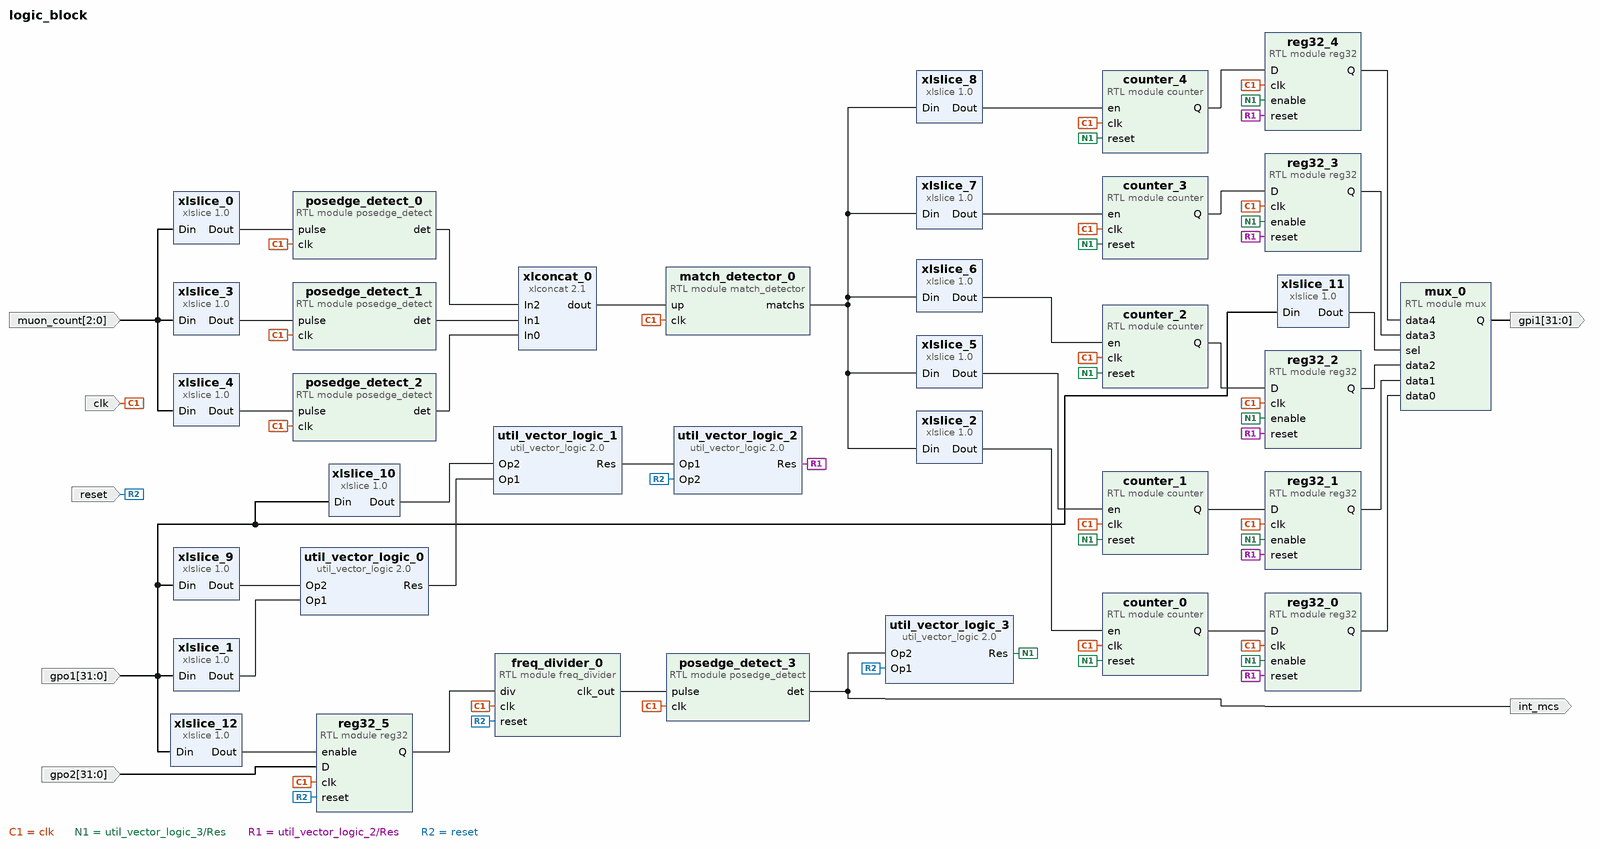
[diagram p0: block diagram of the top level]
# Vivado block design logic_block, xc7a15tcpg236-1, Vivado 2020.2
create_bd_design logic_block

create_bd_port -dir I -from 2 -to 0 -type data muon_count
create_bd_port -dir I -from 31 -to 0 -type data gpo1
create_bd_port -dir I -type rst reset
set_property -dict {CONFIG.POLARITY ACTIVE_HIGH} [get_bd_ports reset]
create_bd_port -dir I -type clk clk
set_property -dict {CONFIG.FREQ_HZ 1000000000} [get_bd_ports clk]
create_bd_port -dir I -from 31 -to 0 -type data gpo2
create_bd_port -dir O -from 31 -to 0 -type data gpi1
create_bd_port -dir O -type data int_mcs

create_bd_cell -type module -reference counter counter_0
create_bd_cell -type module -reference counter counter_1
create_bd_cell -type module -reference counter counter_2
create_bd_cell -type module -reference counter counter_3
create_bd_cell -type module -reference counter counter_4
create_bd_cell -type module -reference freq_divider freq_divider_0
create_bd_cell -type module -reference match_detector match_detector_0
create_bd_cell -type module -reference mux mux_0
create_bd_cell -type module -reference posedge_detect posedge_detect_0
create_bd_cell -type module -reference posedge_detect posedge_detect_1
create_bd_cell -type module -reference posedge_detect posedge_detect_3
create_bd_cell -type module -reference posedge_detect posedge_detect_2
create_bd_cell -type module -reference reg32 reg32_0
create_bd_cell -type module -reference reg32 reg32_1
create_bd_cell -type module -reference reg32 reg32_5
create_bd_cell -type module -reference reg32 reg32_2
create_bd_cell -type module -reference reg32 reg32_3
create_bd_cell -type module -reference reg32 reg32_4
create_bd_cell -type ip -vlnv xilinx.com:ip:util_vector_logic:2.0 util_vector_logic_0
set_property -dict {CONFIG.C_SIZE 1} [get_bd_cells util_vector_logic_0]
create_bd_cell -type ip -vlnv xilinx.com:ip:util_vector_logic:2.0 util_vector_logic_1
set_property -dict {CONFIG.C_SIZE 1} [get_bd_cells util_vector_logic_1]
create_bd_cell -type ip -vlnv xilinx.com:ip:util_vector_logic:2.0 util_vector_logic_3
set_property -dict {CONFIG.C_OPERATION or CONFIG.C_SIZE 1} [get_bd_cells util_vector_logic_3]
create_bd_cell -type ip -vlnv xilinx.com:ip:util_vector_logic:2.0 util_vector_logic_2
set_property -dict {CONFIG.C_OPERATION or CONFIG.C_SIZE 1} [get_bd_cells util_vector_logic_2]
create_bd_cell -type ip -vlnv xilinx.com:ip:xlconcat:2.1 xlconcat_0
set_property -dict {CONFIG.NUM_PORTS 3 CONFIG.dout_width 3} [get_bd_cells xlconcat_0]
create_bd_cell -type ip -vlnv xilinx.com:ip:xlslice:1.0 xlslice_0
set_property -dict {CONFIG.DIN_WIDTH 3} [get_bd_cells xlslice_0]
create_bd_cell -type ip -vlnv xilinx.com:ip:xlslice:1.0 xlslice_3
set_property -dict {CONFIG.DIN_FROM 1 CONFIG.DIN_TO 1 CONFIG.DIN_WIDTH 3 CONFIG.DOUT_WIDTH 1} [get_bd_cells xlslice_3]
create_bd_cell -type ip -vlnv xilinx.com:ip:xlslice:1.0 xlslice_1
set_property -dict {CONFIG.DIN_FROM 7 CONFIG.DIN_TO 7 CONFIG.DIN_WIDTH 32 CONFIG.DOUT_WIDTH 1} [get_bd_cells xlslice_1]
create_bd_cell -type ip -vlnv xilinx.com:ip:xlslice:1.0 xlslice_9
set_property -dict {CONFIG.DIN_FROM 4 CONFIG.DIN_TO 4 CONFIG.DIN_WIDTH 32} [get_bd_cells xlslice_9]
create_bd_cell -type ip -vlnv xilinx.com:ip:xlslice:1.0 xlslice_12
set_property -dict {CONFIG.DIN_FROM 31 CONFIG.DIN_TO 31 CONFIG.DIN_WIDTH 32 CONFIG.DOUT_WIDTH 1} [get_bd_cells xlslice_12]
create_bd_cell -type ip -vlnv xilinx.com:ip:xlslice:1.0 xlslice_2
set_property -dict {CONFIG.DIN_WIDTH 5} [get_bd_cells xlslice_2]
create_bd_cell -type ip -vlnv xilinx.com:ip:xlslice:1.0 xlslice_5
set_property -dict {CONFIG.DIN_FROM 1 CONFIG.DIN_TO 1 CONFIG.DIN_WIDTH 5} [get_bd_cells xlslice_5]
create_bd_cell -type ip -vlnv xilinx.com:ip:xlslice:1.0 xlslice_4
set_property -dict {CONFIG.DIN_FROM 2 CONFIG.DIN_TO 2 CONFIG.DIN_WIDTH 3 CONFIG.DOUT_WIDTH 1} [get_bd_cells xlslice_4]
create_bd_cell -type ip -vlnv xilinx.com:ip:xlslice:1.0 xlslice_6
set_property -dict {CONFIG.DIN_FROM 2 CONFIG.DIN_TO 2 CONFIG.DIN_WIDTH 5 CONFIG.DOUT_WIDTH 1} [get_bd_cells xlslice_6]
create_bd_cell -type ip -vlnv xilinx.com:ip:xlslice:1.0 xlslice_11
set_property -dict {CONFIG.DIN_FROM 7 CONFIG.DIN_TO 0 CONFIG.DIN_WIDTH 32 CONFIG.DOUT_WIDTH 8} [get_bd_cells xlslice_11]
create_bd_cell -type ip -vlnv xilinx.com:ip:xlslice:1.0 xlslice_7
set_property -dict {CONFIG.DIN_FROM 2 CONFIG.DIN_TO 2 CONFIG.DIN_WIDTH 5 CONFIG.DOUT_WIDTH 1} [get_bd_cells xlslice_7]
create_bd_cell -type ip -vlnv xilinx.com:ip:xlslice:1.0 xlslice_8
set_property -dict {CONFIG.DIN_FROM 2 CONFIG.DIN_TO 2 CONFIG.DIN_WIDTH 5 CONFIG.DOUT_WIDTH 1} [get_bd_cells xlslice_8]
create_bd_cell -type ip -vlnv xilinx.com:ip:xlslice:1.0 xlslice_10
set_property -dict {CONFIG.DIN_FROM 0 CONFIG.DIN_TO 0 CONFIG.DIN_WIDTH 32} [get_bd_cells xlslice_10]

# ---- connections ----

connect_bd_net [get_bd_ports muon_count] [get_bd_pins xlslice_0/Din] [get_bd_pins xlslice_3/Din] [get_bd_pins xlslice_4/Din]
connect_bd_net [get_bd_pins xlslice_3/Dout] [get_bd_pins posedge_detect_1/pulse]
connect_bd_net [get_bd_pins xlslice_4/Dout] [get_bd_pins posedge_detect_2/pulse]
connect_bd_net [get_bd_pins xlslice_0/Dout] [get_bd_pins posedge_detect_0/pulse]
connect_bd_net [get_bd_pins posedge_detect_2/det] [get_bd_pins xlconcat_0/In0]
connect_bd_net [get_bd_pins posedge_detect_1/det] [get_bd_pins xlconcat_0/In1]
connect_bd_net [get_bd_pins posedge_detect_0/det] [get_bd_pins xlconcat_0/In2]
connect_bd_net [get_bd_pins xlconcat_0/dout] [get_bd_pins match_detector_0/up]
connect_bd_net [get_bd_pins xlslice_2/Dout] [get_bd_pins counter_0/en]
connect_bd_net [get_bd_pins counter_0/Q] [get_bd_pins reg32_0/D]
connect_bd_net -net counter_0_Q1 [get_bd_pins counter_1/Q] [get_bd_pins reg32_1/D]
connect_bd_net -net xlslice_2_Dout1 [get_bd_pins xlslice_5/Dout] [get_bd_pins counter_1/en]
connect_bd_net [get_bd_pins match_detector_0/matchs] \
  [get_bd_pins xlslice_2/Din] [get_bd_pins xlslice_5/Din] [get_bd_pins xlslice_6/Din] [get_bd_pins xlslice_7/Din] \
  [get_bd_pins xlslice_8/Din]
connect_bd_net [get_bd_pins xlslice_6/Dout] [get_bd_pins counter_2/en]
connect_bd_net [get_bd_pins xlslice_7/Dout] [get_bd_pins counter_3/en]
connect_bd_net [get_bd_pins counter_3/Q] [get_bd_pins reg32_3/D]
connect_bd_net [get_bd_pins counter_2/Q] [get_bd_pins reg32_2/D]
connect_bd_net [get_bd_pins reg32_0/Q] [get_bd_pins mux_0/data0]
connect_bd_net [get_bd_pins reg32_1/Q] [get_bd_pins mux_0/data1]
connect_bd_net [get_bd_pins reg32_2/Q] [get_bd_pins mux_0/data2]
connect_bd_net [get_bd_pins reg32_3/Q] [get_bd_pins mux_0/data3]
connect_bd_net [get_bd_pins xlslice_8/Dout] [get_bd_pins counter_4/en]
connect_bd_net [get_bd_pins counter_4/Q] [get_bd_pins reg32_4/D]
connect_bd_net [get_bd_pins reg32_4/Q] [get_bd_pins mux_0/data4]
connect_bd_net [get_bd_pins xlslice_1/Dout] [get_bd_pins util_vector_logic_0/Op1]
connect_bd_net [get_bd_pins xlslice_9/Dout] [get_bd_pins util_vector_logic_0/Op2]
connect_bd_net -net gpo1_1 [get_bd_ports gpo1] \
  [get_bd_pins xlslice_1/Din] [get_bd_pins xlslice_9/Din] [get_bd_pins xlslice_12/Din] [get_bd_pins xlslice_11/Din] \
  [get_bd_pins xlslice_10/Din]
connect_bd_net [get_bd_pins util_vector_logic_0/Res] [get_bd_pins util_vector_logic_1/Op1]
connect_bd_net [get_bd_pins xlslice_10/Dout] [get_bd_pins util_vector_logic_1/Op2]
connect_bd_net [get_bd_pins util_vector_logic_1/Res] [get_bd_pins util_vector_logic_2/Op1]
connect_bd_net [get_bd_pins xlslice_11/Dout] [get_bd_pins mux_0/sel]
connect_bd_net [get_bd_pins reg32_5/Q] [get_bd_pins freq_divider_0/div]
connect_bd_net [get_bd_pins freq_divider_0/clk_out] [get_bd_pins posedge_detect_3/pulse]
connect_bd_net [get_bd_pins posedge_detect_3/det] [get_bd_ports int_mcs] [get_bd_pins util_vector_logic_3/Op2]
connect_bd_net [get_bd_ports clk] \
  [get_bd_pins counter_0/clk] [get_bd_pins counter_1/clk] [get_bd_pins counter_2/clk] [get_bd_pins counter_3/clk] \
  [get_bd_pins counter_4/clk] [get_bd_pins freq_divider_0/clk] [get_bd_pins match_detector_0/clk] \
  [get_bd_pins posedge_detect_0/clk] [get_bd_pins posedge_detect_1/clk] [get_bd_pins posedge_detect_3/clk] \
  [get_bd_pins posedge_detect_2/clk] [get_bd_pins reg32_0/clk] [get_bd_pins reg32_1/clk] [get_bd_pins reg32_5/clk] \
  [get_bd_pins reg32_2/clk] [get_bd_pins reg32_3/clk] [get_bd_pins reg32_4/clk]
connect_bd_net [get_bd_pins util_vector_logic_3/Res] \
  [get_bd_pins counter_0/reset] [get_bd_pins counter_1/reset] [get_bd_pins counter_2/reset] [get_bd_pins counter_3/reset] \
  [get_bd_pins counter_4/reset] [get_bd_pins reg32_0/enable] [get_bd_pins reg32_1/enable] [get_bd_pins reg32_2/enable] \
  [get_bd_pins reg32_3/enable] [get_bd_pins reg32_4/enable]
connect_bd_net [get_bd_pins util_vector_logic_2/Res] \
  [get_bd_pins reg32_0/reset] [get_bd_pins reg32_1/reset] [get_bd_pins reg32_2/reset] [get_bd_pins reg32_3/reset] \
  [get_bd_pins reg32_4/reset]
connect_bd_net [get_bd_pins mux_0/Q] [get_bd_ports gpi1]
connect_bd_net [get_bd_ports reset] \
  [get_bd_pins freq_divider_0/reset] [get_bd_pins reg32_5/reset] [get_bd_pins util_vector_logic_3/Op1] \
  [get_bd_pins util_vector_logic_2/Op2]
connect_bd_net -net gpo2_1 [get_bd_ports gpo2] [get_bd_pins reg32_5/D]
connect_bd_net [get_bd_pins xlslice_12/Dout] [get_bd_pins reg32_5/enable]

validate_bd_design
save_bd_design
